# Altium project PCB_High_Voltage_Sensor.PrjPcb
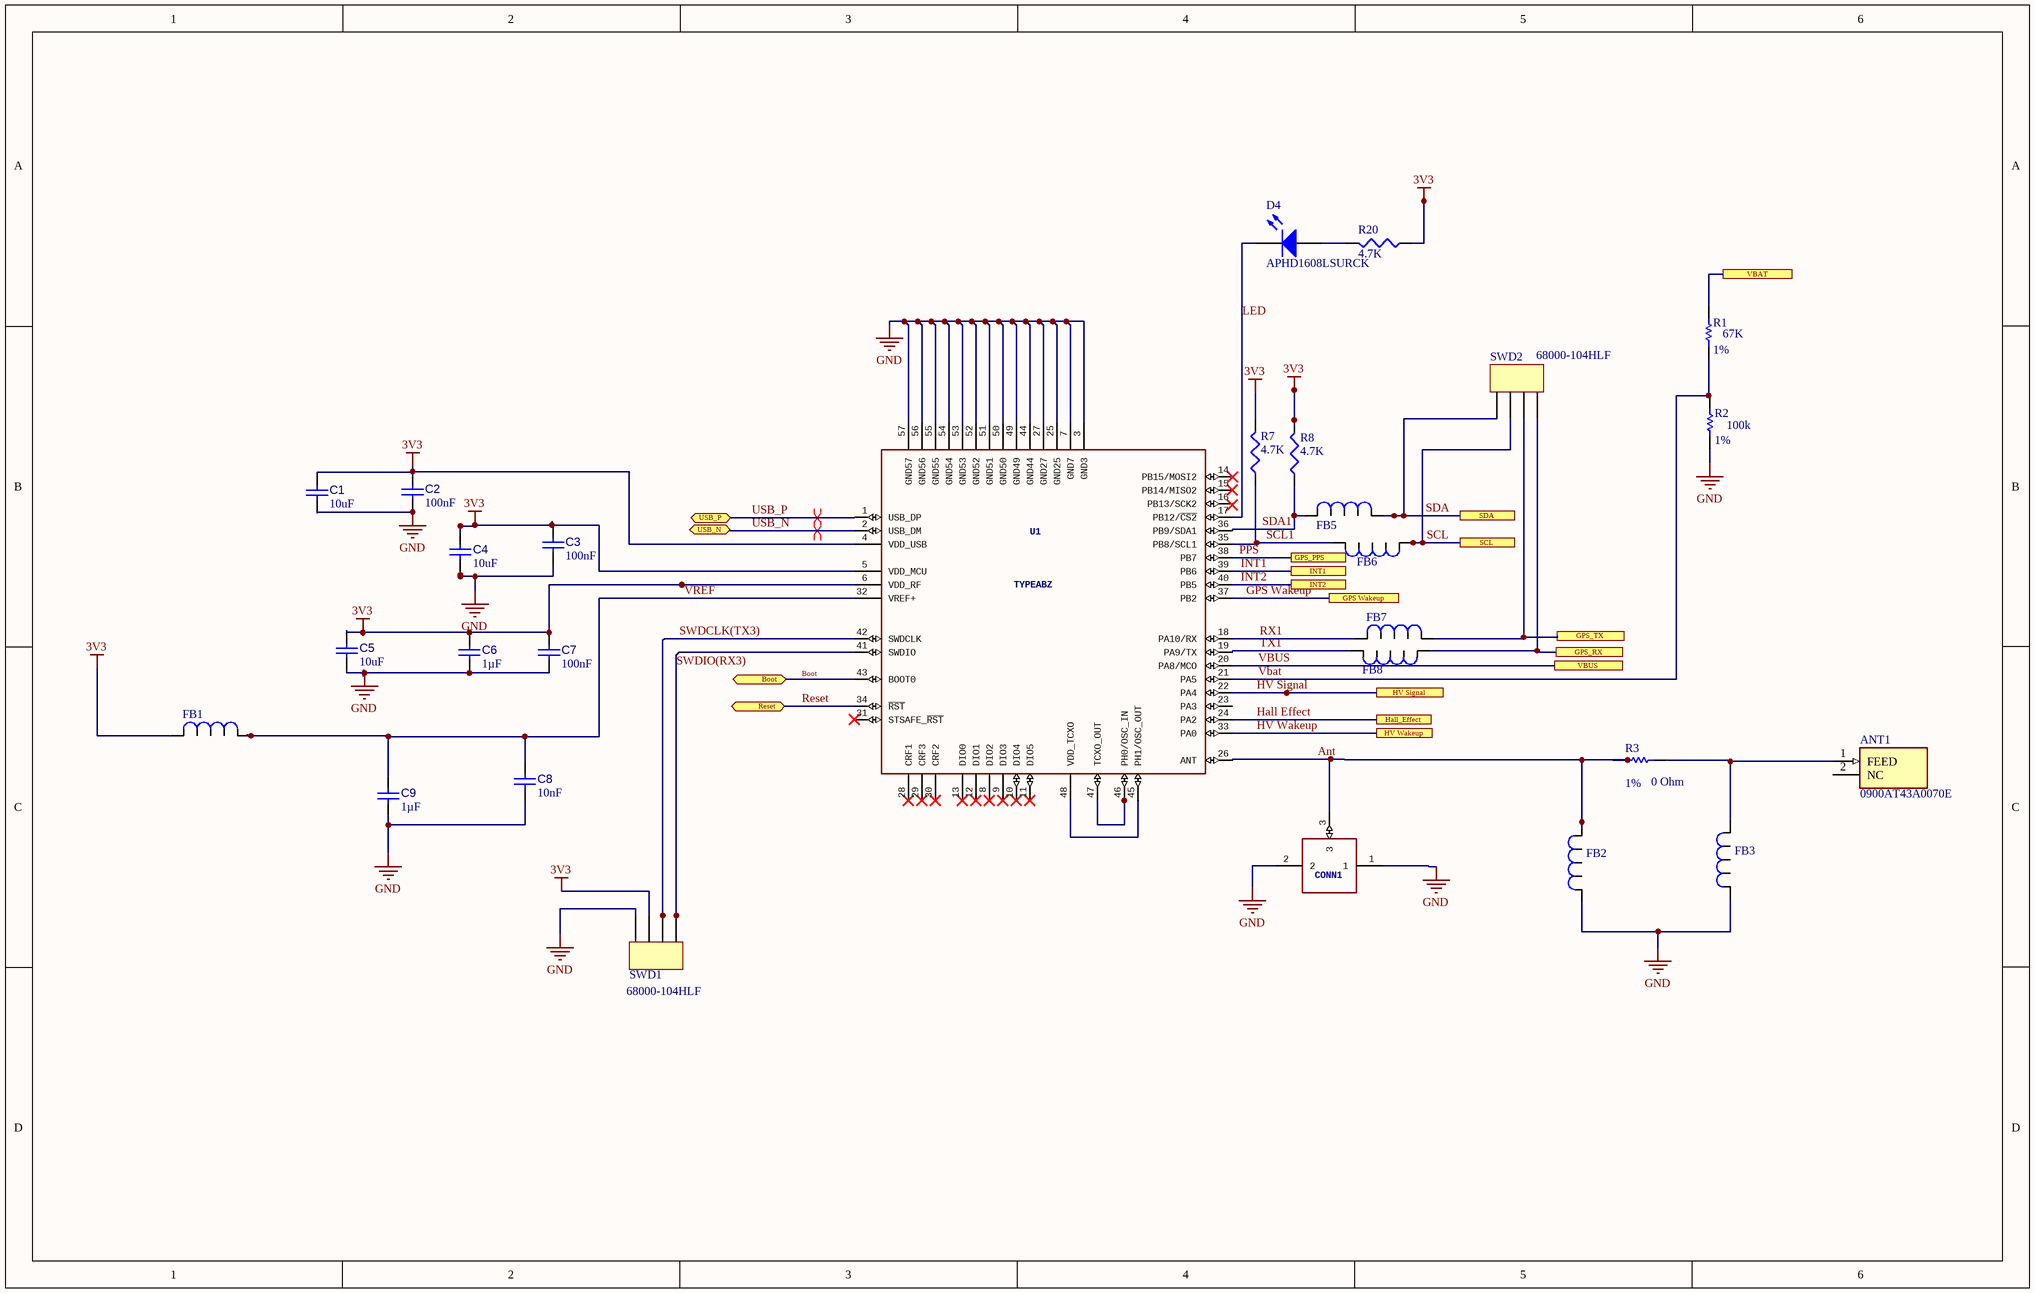
[diagram p0: [1]MCU.SchDoc]
9 sheets, 113 parts. Net scope: flat (ports and power ports of the same name join across sheets).
Board file: PCB_High_Voltage_Sensor.PcbDoc
Sheets:
  [1]MCU.SchDoc
  [2]Battery.SchDoc
  [3]USB.SchDoc
  [4]Button.SchDoc
  [5]High_V_Sensor.SchDoc
  [7]3-axis-accelerometer.SchDoc
  [8]Halleffect.SchDoc
  [9]GPSGNSS.SchDoc
  [6]Battery Managment.SchDoc

## Sheet [1]MCU.SchDoc
size B

### Parts
(Parts that share a designator on the sheet are numbered #1, #2 ... from top to bottom, then left to right.)
ANT1  0900AT43A0070E  [ANTC7020X90N]
C1  value 10uF  [CAPC1608X90X40ML10T20]  (hidden comment: Capacitor 10uF +/-10% 50 V 0603)
C2  value 100nF  [CAPC1608X90X40ML10T20]  (hidden comment: Capacitor 100 nF +/-10% 50 V 0603)
C3  value 100nF  [CAPC1608X90X40ML10T20]  (hidden comment: Capacitor 100 nF +/-10% 50 V 0603)
C4  value 10uF  [CAPC1608X90X40ML10T20]  (hidden comment: Capacitor 10uF +/-10% 50 V 0603)
C5  value 10uF  [CAPC1608X90X40ML10T20]  (hidden comment: Capacitor 10uF +/-10% 50 V 0603)
C6  value 1µF  [CAPC1608X90X40ML10T20]  (hidden comment: Capacitor 1 uF +/- 10% 25 V 0603)
C7  value 100nF  [CAPC1608X90X40ML10T20]  (hidden comment: Capacitor 100 nF +/-10% 50 V 0603)
C8  10nF  [CAPC1608X90X40ML10T20]
C9  value 1µF  [CAPC1608X90X40ML10T20]  (hidden comment: Capacitor 1 uF +/- 10% 25 V 0603)
CONN1  U.FL-R-SMT-1  [U.FL-R-SMT-1]  (value not drawn)
D4  APHD1608LSURCK  [LED BLUE CLEAR [0603] 2mA]
FB1  BLM18AG102SN1D  [Ferrite Bead]  (value not drawn)
FB2  BLM18AG102SN1D  [Ferrite Bead]  (value not drawn)
FB3  BLM18AG102SN1D  [Ferrite Bead]  (value not drawn)
FB5  BLM18AG102SN1D  [Ferrite Bead]  (value not drawn)
FB6  BLM18AG102SN1D  [Ferrite Bead]  (value not drawn)
FB7  BLM18AG102SN1D  [Ferrite Bead]  (value not drawn)
FB8  BLM18AG102SN1D  [Ferrite Bead]  (value not drawn)
R1#1  value 67K  Tolerance: 1%  [RES 0603]  (hidden comment: RES 67K 1% 0.1W [0603])
R2#1  value 100k  Tolerance: 1%  [RES 0603]  (hidden comment: RES 100K 5% 0.1W [0603])
R3  value 0 Ohm  Tolerance: 1%  [RESC0603]  (hidden comment: 0)
R7  4.7K  [RESC0603]
R8  4.7K  [RESC0603]
R20  4.7K  [RESC0603]
SWD1  68000-104HLF  [4POS_HEADER]
SWD2#1  68000-104HLF  [4POS_HEADER]
U1  TYPEABZ  [CMWX1ZZABZ]

### Ports
Boot (bidir), GPS Wakeup, GPS_PPS, GPS_RX, GPS_TX, Hall_Effect, HV Signal, HV Wakeup, INT1, INT2, Reset (bidir), SCL, SDA, USB_N (bidir), USB_P (bidir), VBAT, VBUS

### Nets
3V3: C1.2 C2.2 C3.2 C4.2 C5.2 C6.2 C7.2 FB1.2 R7.2 R8.2 R20.1 SWD1.2 U1.4(VDD_USB) U1.5(VDD_MCU) U1.6(VDD_RF)
GND: C1.1 C2.1 C3.1 C4.1 C5.1 C6.1 C7.1 C8.1 C9.2 CONN1.1 CONN1.2 FB2.2 FB3.2 R2#1.1 SWD1.1 U1.3(GND3) U1.7(GND7) U1.25(GND25) U1.27(GND27) U1.44(GND44) U1.49(GND49) U1.50(GND50) U1.51(GND51) U1.52(GND52) U1.53(GND53) U1.54(GND54) U1.55(GND55) U1.56(GND56) U1.57(GND57)
Ant: CONN1.3 FB2.1 R3.1 U1.26(ANT)
Boot: U1.43(BOOT0) ; port Boot
GPS RX: FB8.1 SWD2#1.1 ; port GPS_RX
GPS TX: FB7.1 SWD2#1.2 ; port GPS_TX
GPS Wakeup: U1.37(PB2) ; port GPS Wakeup
Hall Effect: U1.24(PA2) ; port Hall_Effect
HV Signal: U1.22(PA4) ; port HV Signal
HV Wakeup: U1.33(PA0) ; port HV Wakeup
INT1: U1.39(PB6) ; port INT1
INT2: U1.40(PB5) ; port INT2
LED: D4.1 U1.17(PB12/~{CS2})
PPS: U1.38(PB7) ; port GPS_PPS  [project net GPS_PPS]
Reset: U1.34(~{RST}) ; port Reset
RX1: FB7.2 U1.18(PA10/RX)
SCL: FB6.2 SWD2#1.3 ; port SCL
SCL1: FB6.1 R7.1 U1.35(PB8/SCL1)
SDA: FB5.1 SWD2#1.4 ; port SDA
SDA1: FB5.2 R8.1 U1.36(PB9/SDA1)
SWDCLK(TX3): SWD1.3 U1.42(SWDCLK)
SWDIO(RX3): SWD1.4 U1.41(SWDIO)
TX1: FB8.2 U1.19(PA9/TX)
USB_N: U1.2(USB_DM) ; port USB_N
USB_P: U1.1(USB_DP) ; port USB_P
Vbat: R1#1.1 R2#1.2 U1.21(PA5)
VBUS: U1.20(PA8/MCO) ; port VBUS
VREF: C8.2 C9.1 FB1.1 U1.32(VREF+)
NetANT1_1: ANT1.1(FEED) FB3.1 R3.2
NetD4_2: D4.2 R20.2
NetR1#1_2: R1#1.2 ; port VBAT
NetU1_45: U1.45(PH1/OSC_OUT) U1.48(VDD_TCXO)
NetU1_46: U1.46(PH0/OSC_IN) U1.47(TCXO_OUT)

Not connected (* = marked no-connect by the designer): ANT1 2(NC); U1 8(DIO2)* 9(DIO3)* 10(DIO4)* 11(DIO5)* 12(DIO1)* 13(DIO0)* 14(PB15/MOSI2) 15(PB14/MISO2)* 16(PB13/SCK2) 23(PA3) 28(CRF1)* 29(CRF3)* 30(CRF2)* 31(STSAFE_~{RST})*

### Layout directives
differential pair; differential pair class USBPair: USB_N, USB_P

### Notes on the sheet
- Title
- Size:
- Date:
- A3
- Number:
- Time:
- Revision:
- Sheet
- of
- File:

### Library data of the parts
ANT1 = 0900AT43A0070E: Antenna; Manufacturer_Name: JOHANSON TECHNOLOGY; Datasheet Link: https://www.johansontechnology.com/datasheets/0900AT43A0070/0900AT43A0070.pdf; Height: 0.9mm; Manufacturer_Part_Number: 0900AT43A0070E
C1 C4 C5 = CMP-001-00017-4: Chip Capacitor, 10uF, +/- 10%, 50 V, 0603 (1608 Metric); Capacitor Type: Ceramic; Voltage Rating: 50V; RoHS Compliant: True; Max Operating Temperature: 125°C; Pins: 2; Mounting Technology: SM; Min Operating Temperature: -55°C; Tolerance: 10%; Case/Package: 0603
C2 C3 C7 = CMP-001-00017-4: Chip Capacitor, 100 nF, +/- 10%, 50 V, 0603 (1608 Metric); Capacitor Type: Ceramic; Voltage Rating: 50V; RoHS Compliant: True; Max Operating Temperature: 125°C; Pins: 2; Mounting Technology: SM; Min Operating Temperature: -55°C; Tolerance: 10%; Case/Package: 0603
C6 C9 = CMP-001-00005-4: Chip Capacitor, 1 uF, +/- 10%, 25 V, 0603 (1608 Metric); Voltage Rating: 25V; Capacitor Type: Ceramic; Min Operating Temperature: -55°C; Tolerance: 10%; Max Operating Temperature: 125°C; Case/Package: 0603; RoHS Compliant: True; Mounting Technology: SM; Pins: 2
C8 = CMP-001-00017-4: Chip Capacitor, 10 nF, +/- 10%, 50 V, 0603 (1608 Metric); Capacitor Type: Ceramic; Voltage Rating: 50V; RoHS Compliant: True; Value: 10nF; Max Operating Temperature: 125°C; Pins: 2; Mounting Technology: SM; Min Operating Temperature: -55°C; Tolerance: 10%; Case/Package: 0603
CONN1 = U.FL-R-SMT-1: GateName_1: G$1; SymbolName_1: U.FL-R-SMT-1; LibraryName: Kris; DeviceSetName: U.FL-R-SMT-1
D4 = LED BLUE CLEAR 1608 SMD: LED RED  [0603] 2mA; Datasheet: http://www.kingbrightusa.com/images/catalog/SPEC/APHD1608LQBC-D.pdf; Supplier 1: Digi-Key; Supplier Part Number 1: 754-2034-1-ND; PN: APHD1608LSURCK
FB1-FB3 FB5-FB8 = Ferrite Bead: Ferrite Bead 1KOhm @100MHz; Datasheet: https://www.murata.com/en-us/products/productdata/8796738650142/ENFA0003.pdf?src-supplier=Digi-Key; Supplier 1: Mouser; Supplier Part Number 1: 81-BLM11A102S; PN: BLM18AG102SN1D
R1#1 R2#1 = RES 3.3M 1% 0.1W [0603]: Supplier 1: Digi-Key; Supplier Part Number 1: 541-3.30MHCT-ND
R3 = RES 0 Ohm [0603]: RES 0 Ohm 1% 0.1W [0603]; Supplier 1: Mouser; Supplier Part Number 1: 667-ERJ-3GEY0R00V; Datasheet: http://industrial.panasonic.com/cdbs/www-data/pdf/RDA0000/AOA0000C301.pdf?src-supplier=Farnell
R7 R8 R20 = RESISTOR
SWD1 SWD2#1 = 68000-104HLF: 4 Positions Header, Unshrouded Connector 0.100" (2.54mm) Through Hole Gold or Gold, GXT™; Manufacturer 1: Amphenol FCI; Number of Positions: 4; Gender: Male; Connector Type: Male Pin; Voltage Rating: 1.5kV; Current Rating: 3A; Insulation Resistance: 5GR; Mating Post Length: 5.84mm; Mount: Through Hole; Colour: Black; Housing Colour: Black; Housing Material: Thermoplastic; Contact Plating: Nickel,Gold,GXT; Contact Material: Bronze; Min Operating Temperature: -65°C; Max Operating Temperature: 125°C; Number of Rows: 1; Packaging: Bulk; Package Quantity: 100; Termination: Solder; Number of Contacts: 4; Orientation: Straight; Max Voltage Rating (AC): 1.5kV; Contact Gender: Male; Length: 10.16mm; Pitch: 2.54mm; Depth: 2.41mm; Termination Post Length: 2.41mm; Contact Mating Length: 0.23inch; Radiation Hardening: No; REACH SVHC: No SVHC; Flammability Rating: UL94 V-0; ComponentLink1URL: https://datasheet.ciiva.com/16726/68000-16726213.pdf; ComponentLink1Description: https://datasheet.ciiva.com/16726/68000-16726213.pdf; ComponentLink2URL: https://datasheet.ciiva.com/10149/68000-10149830.pdf; ComponentLink2Description: https://datasheet.ciiva.com/10149/68000-10149830.pdf; ComponentLink3URL: https://datasheet.ciiva.com/46395/1914865-46395854.pdf; ComponentLink3Description: https://datasheet.ciiva.com/46395/1914865-46395854.pdf; ComponentLink4URL: https://datasheet.ciiva.com/728/68000-728879.pdf; ComponentLink4Description: https://datasheet.ciiva.com/728/68000-728879.pdf; Description 1: 4 Positions Header, Unshrouded Connector 0.100" (2.54mm) Through Hole Gold or Gold, GXT™; Manufacturer Part Number 1: 68000-104HLF; Pricing 1: 1=0.33, 10=0.316, 100=0.2212, 500=0.18964, 1000=0.15803, 5000=0.13545, 10000=0.12642 (USD); Stock 1: 10785; Supplier 1: Digi-Key; Supplier Part Number 1: 609-3248-ND
U1 = TYPEABZ: CMWX1ZZABZ-078; GateName_1: G$1; SymbolName_1: TYPEABZ; DeviceSetName: TYPEABZ

## Sheet [2]Battery.SchDoc
size B
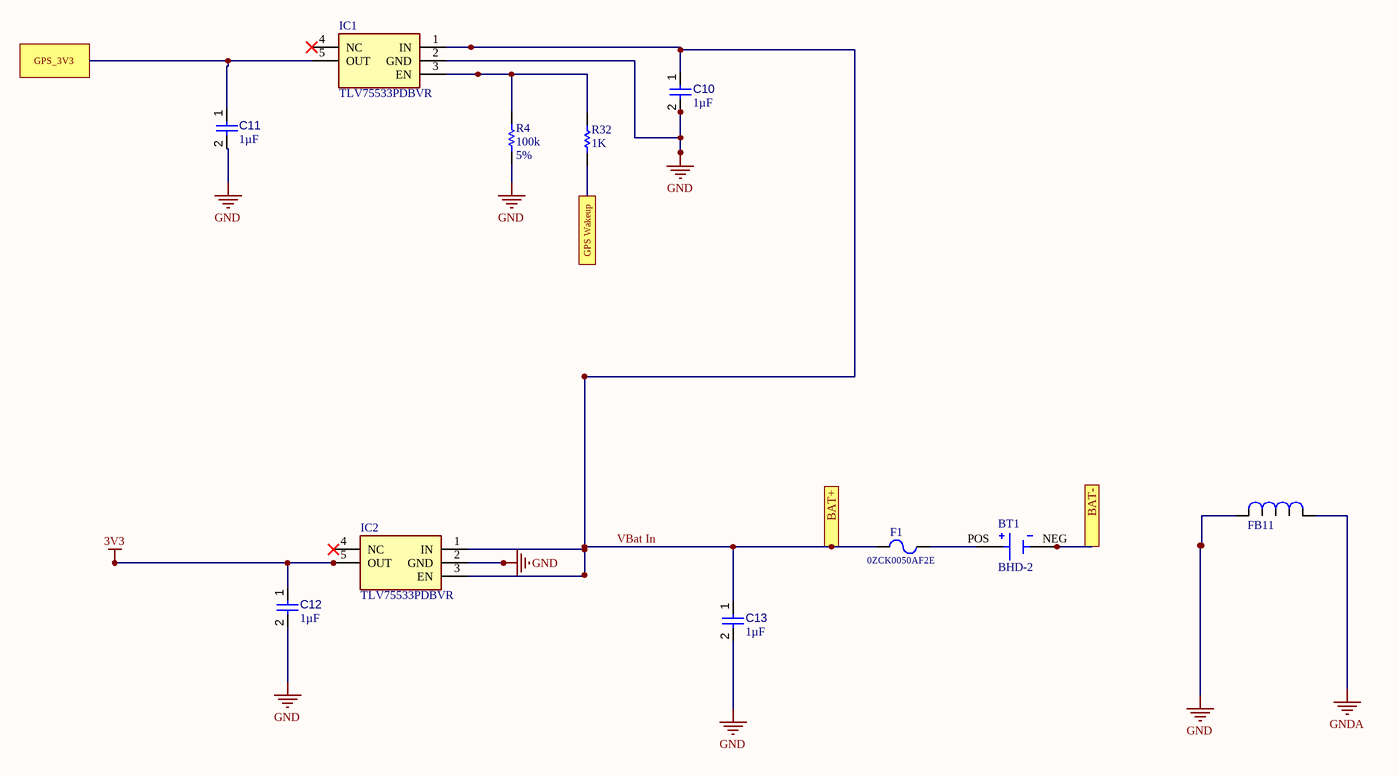
[diagram p1: [2]Battery.SchDoc]

### Parts
BT1  BHD-2  [BAT_BHD-2]
C10  value 1µF  [CAPC1608X90X40ML10T20]  (hidden comment: Capacitor 1 uF +/- 10% 25 V 0603)
C11  value 1µF  [CAPC1608X90X40ML10T20]  (hidden comment: Capacitor 1 uF +/- 10% 25 V 0603)
C12  value 1µF  [CAPC1608X90X40ML10T20]  (hidden comment: Capacitor 1 uF +/- 10% 25 V 0603)
C13  value 1µF  [CAPC1608X90X40ML10T20]  (hidden comment: Capacitor 1 uF +/- 10% 25 V 0603)
F1  MF PN: 0ZCK0050AF2E  [PTC RESET FUSE 9V 500MA 0805]  (hidden comment: PTC 9V 500mA)
FB11  BLM18AG102SN1D  [Ferrite Bead]  (value not drawn)
IC1  TLV75533PDBVR  [SOT95P280X145-5N]
IC2  TLV75533PDBVR  [SOT95P280X145-5N]
R4  value 100k  Tolerance: 5%  [RES 0603]  (hidden comment: RES 100K 5% 0.1W [0603])
R32  1K  [RES 0603]

### Ports
BAT+, BAT-, GPS Wakeup, GPS_3V3

### Nets
3V3: C12.1 IC2.5(OUT)
GND: C10.2 C11.2 C12.2 C13.2 FB11.2 IC1.2(GND) IC2.2(GND) R4.1
GNDA: FB11.1
BAT-: BT1.NEG ; port BAT-
GPS VCC: C11.1 IC1.5(OUT) ; port GPS_3V3
GPS Wakeup: R32.2 ; port GPS Wakeup
VBat In: C10.1 C13.1 F1.1 IC1.1(IN) IC2.1(IN) IC2.3(EN) ; port BAT+
NetBT1_POS: BT1.POS F1.2
NetIC1_3: IC1.3(EN) R4.2 R32.1

Not connected (* = marked no-connect by the designer): IC1 4(NC)*; IC2 4(NC)*

### Notes on the sheet
- Title
- Size:
- Date:
- A3
- Number:
- Time:
- Revision:
- Sheet
- of
- File:

### Library data of the parts
BT1 = BHD-2: BATTERY HOLDER D PC PIN; MF: MPD; Value: *; Package: None; MP: BHD-2; Price: None; Availability: Bad; SnapEDA_Link: https://www.snapeda.com/parts/BHD-2/Memory%20Protection%20Devices/view-part/4219639/?ref=snap; BuyPart: https://www.snapeda.com/parts/BHD-2/Memory%20Protection%20Devices/view-part/4219639/?ref=eda
C10-C13 = CMP-001-00005-4: as C6 on sheet [1]MCU; Min Operating Temperature: -55°C; Tolerance: 10%; Max Operating Temperature: 125°C; Case/Package: 0603; RoHS Compliant: True; Mounting Technology: SM; Pins: 2
F1 = PTC RESET FUSE 9V 500MA 0805: DK PN: 507-2075-1-ND; Supplier 1: Digi-Key; Supplier Part Number 1: 507-2075-1-ND; Datasheet: https://www.belfuse.com/resources/datasheets/circuitprotection/ds-cp-0zck-series.pdf
FB11 = Ferrite Bead: Ferrite Bead 1KOhm @100MHz; Datasheet: https://www.murata.com/en-us/products/productdata/8796738650142/ENFA0003.pdf?src-supplier=Digi-Key; Supplier 1: Mouser; Supplier Part Number 1: 81-BLM11A102S; PN: BLM18AG102SN1D
IC1 IC2 = TLV75533PDBVR: Integrated Circuit; Manufacturer_Name: Texas Instruments; Datasheet Link: http://www.ti.com/lit/gpn/tlv755p; Height: 1.45mm; Manufacturer_Part_Number: TLV75533PDBVR; Mouser Part Number: 595-TLV75533PDBVR; Mouser Price/Stock: https://www.mouser.co.uk/ProductDetail/Texas-Instruments/TLV75533PDBVR?qs=55YtniHzbhAKEwqeO2xJXQ%3D%3D; Arrow Part Number: TLV75533PDBVR; Arrow Price/Stock: https://www.arrow.com/en/products/tlv75533pdbvr/texas-instruments
R4 = RES 3.3M 1% 0.1W [0603]: Supplier 1: Digi-Key; Supplier Part Number 1: 541-3.30MHCT-ND
R32 = RES 3.3M 1% 0.1W [0603]: 1K 1% 0.1W [0603]; Value: 1M; Supplier 1: Digi-Key; Supplier Part Number 1: 541-3.30MHCT-ND; Tolerance: 1%

## Sheet [3]USB.SchDoc
size B
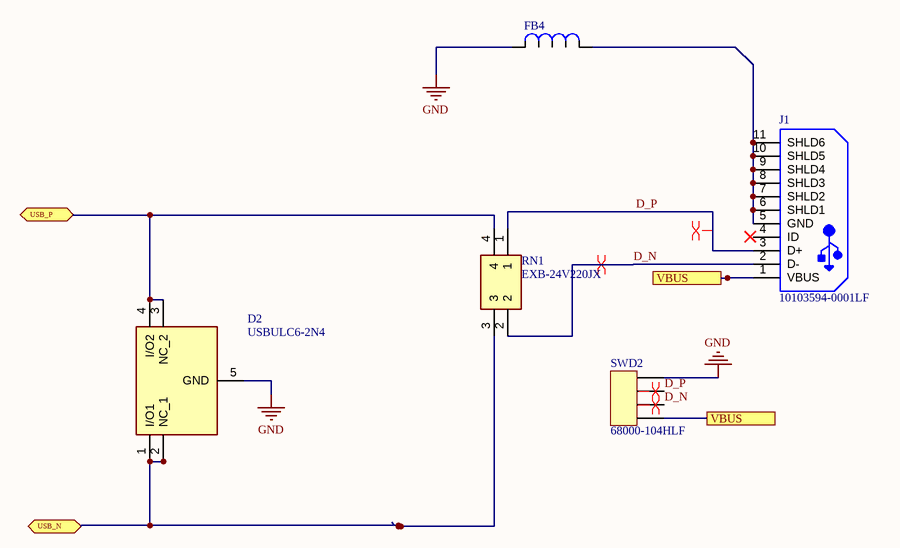
[diagram p2: [3]USB.SchDoc]

### Parts
(Parts that share a designator on the sheet are numbered #1, #2 ... from top to bottom, then left to right.)
D2  USBULC6-2N4  [SON40P100X80X55-5N-D]
FB4  BLM18AG102SN1D  [Ferrite Bead]  (value not drawn)
J1  10103594-0001LF  [FCI-10103594-0001LF_V]
RN1  EXB-24V220JX  [EXB24V220JX]
SWD2#2  68000-104HLF  [4POS_HEADER]

### Ports
USB_N (bidir), USB_P (bidir), VBUS

### Nets
GND: D2.5(GND) FB4.2 SWD2#2.1
D_N: J1.2(D-) RN1.2 SWD2#2.3
D_P: J1.3(D+) RN1.1 SWD2#2.2
USB_N: D2.1(I/O1) D2.2(NC_1) RN1.3 ; port USB_N
USB_P: D2.3(NC_2) D2.4(I/O2) RN1.4 ; port USB_P
VBUS: J1.1(VBUS) SWD2#2.4 ; port VBUS
NetFB4_1: FB4.1 J1.5(GND) J1.6(SHLD1) J1.7(SHLD2) J1.8(SHLD3) J1.9(SHLD4) J1.10(SHLD5) J1.11(SHLD6)

Not connected (* = marked no-connect by the designer): J1 4(ID)

### Layout directives
differential pair; differential pair class USBPair1: (no net found under the mark), D_N, D_P

### Notes on the sheet
- 8
- 7
- 6
- 5
- 4
- 3
- DWG. NO.
- REV.
- SHT.
- REVISION
- 2
- DESCRIPTION
- DATE
- 1
- APPROVED
- THIS DOCUMENT AND THE DATA DISCLOSED HEREIN OR HEREWITH IS THE PROPERTY OF ALTIUM LIMITED AND MAY BE FREELY DISTRIBUTED IN WHOLE. NO RIGHTS ARE RESERVED OR EXPRESS OR IMPLIED WARANTEE GIVEN.
- F
- E
- D
- C
- B
- A
- SCALE:
- A3
- SIZE
- CAGE CODE
- FILE NAME
- DWG NO.
- SHEET
- OF
- REV

### Library data of the parts
D2 = USBULC6-2N4: TVS Diode (Bi-directional); Manufacturer_Name: STMicroelectronics; Datasheet Link: https://www.mouser.com/datasheet/2/389/usbulc6-2n4-957402.pdf; Height: 0.55mm; Manufacturer_Part_Number: USBULC6-2N4; Arrow Part Number: USBULC6-2N4; Arrow Price/Stock: https://www.arrow.com/en/products/usbulc6-2n4/stmicroelectronics; Mouser Part Number: 511-USBULC6-2N4; Mouser Price/Stock: https://www.mouser.co.uk/ProductDetail/STMicroelectronics/USBULC6-2N4?qs=Rlwi1sSxVL7F1p%2FNjkpR0Q%3D%3D
FB4 = Ferrite Bead: Ferrite Bead 1KOhm @100MHz; Datasheet: https://www.murata.com/en-us/products/productdata/8796738650142/ENFA0003.pdf?src-supplier=Digi-Key; Supplier 1: Mouser; Supplier Part Number 1: 81-BLM11A102S; PN: BLM18AG102SN1D
J1 = CMP-002-00038-1: Micro USB 2.0 B Receptacle, 5 Position, Height 3.24 mm, -55 to 85 degC, RoHS, Tape and Reel; Manufacturer: FCI Electronics; Voltage Rating: 100V; Gender: Female; Current Rating: 1.8A; Min Operating Temperature: -55°C; Pins: 5; Contact Plating: Gold; Package Description: 5-Pin Surface Mount Device, Body 8.04 x 5.62 mm; RoHS Compliant: True; Lead Pitch: 0.65mm; Packaging: TapeandReel; Case/Package: FCI-10103594-0001LF; Manufacturer URL: http://portal.fciconnect.com/; Mounting Technology: SM; Datasheet Version: Rev. A, 06/2010; Connector Type: USB; Contact Material: Copper; Datasheet URL: http://portal.fciconnect.com/Comergent//fci/drawing/10103594.pdf; Max Operating Temperature: 85°C; Package Quantity: 1500; Package Reference: FCI-10103594-0001LF
RN1 = EXB-24V220JX: Resistor Network; Manufacturer_Name: Panasonic; Datasheet Link: https://www.snapeda.com/parts/EXB-24V220JX/Panasonic%20Electronic/datasheet/; Height: 0.45mm; Manufacturer_Part_Number: EXB-24V220JX; Mouser Part Number: 667-EXB-24V220JX; Mouser Price/Stock: https://www.mouser.co.uk/ProductDetail/Panasonic/EXB-24V220JX?qs=oE3VwAv%2FYtkKhK0m4TkqFQ%3D%3D
SWD2#2 = 68000-104HLF: as SWD1 on sheet [1]MCU; Mount: Through Hole; Colour: Black; Housing Colour: Black; Housing Material: Thermoplastic; Contact Plating: Nickel,Gold,GXT; Contact Material: Bronze; Min Operating Temperature: -65°C; Max Operating Temperature: 125°C; Number of Rows: 1; Packaging: Bulk; Package Quantity: 100; Termination: Solder; Number of Contacts: 4; Orientation: Straight; Max Voltage Rating (AC): 1.5kV; Contact Gender: Male; Length: 10.16mm; Pitch: 2.54mm; Depth: 2.41mm; Termination Post Length: 2.41mm; Contact Mating Length: 0.23inch; Radiation Hardening: No; REACH SVHC: No SVHC; Flammability Rating: UL94 V-0; ComponentLink1URL: https://datasheet.ciiva.com/16726/68000-16726213.pdf; ComponentLink1Description: https://datasheet.ciiva.com/16726/68000-16726213.pdf; ComponentLink2URL: https://datasheet.ciiva.com/10149/68000-10149830.pdf; ComponentLink2Description: https://datasheet.ciiva.com/10149/68000-10149830.pdf; ComponentLink3URL: https://datasheet.ciiva.com/46395/1914865-46395854.pdf; ComponentLink3Description: https://datasheet.ciiva.com/46395/1914865-46395854.pdf; ComponentLink4URL: https://datasheet.ciiva.com/728/68000-728879.pdf; ComponentLink4Description: https://datasheet.ciiva.com/728/68000-728879.pdf; Description 1: 4 Positions Header, Unshrouded Connector 0.100" (2.54mm) Through Hole Gold or Gold, GXT™; Manufacturer Part Number 1: 68000-104HLF; Pricing 1: 1=0.33, 10=0.316, 100=0.2212, 500=0.18964, 1000=0.15803, 5000=0.13545, 10000=0.12642 (USD); Stock 1: 10785; Supplier 1: Digi-Key; Supplier Part Number 1: 609-3248-ND

## Sheet [4]Button.SchDoc
size B
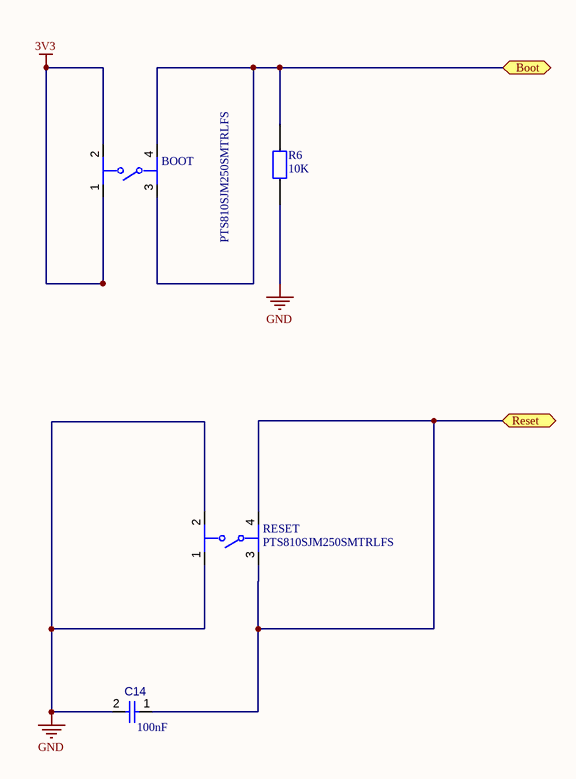
[diagram p3: [4]Button.SchDoc]

### Parts
BOOT  PTS810SJM250SMTRLFS  [FP-PTS810SJM250SMTRLFS-MFG]
C14  value 100nF  [CAPC1608X90X40ML10T20]  (hidden comment: Capacitor 100 nF +/-10% 50 V 0603)
R6  10K  [RESC0603]
RESET  PTS810SJM250SMTRLFS  [FP-PTS810SJM250SMTRLFS-MFG]

### Ports
Boot (bidir), Reset (bidir)

### Nets
3V3: BOOT.1 BOOT.2
GND: C14.2 R6.1 RESET.1 RESET.2
Boot: BOOT.3 BOOT.4 R6.2 ; port Boot
Reset: C14.1 RESET.3 RESET.4 ; port Reset

### Notes on the sheet
- 8
- 7
- 6
- 5
- 4
- 3
- DWG. NO.
- REV.
- SHT.
- REVISION
- 2
- DESCRIPTION
- DATE
- 1
- APPROVED
- THIS DOCUMENT AND THE DATA DISCLOSED HEREIN OR HEREWITH IS THE PROPERTY OF ALTIUM LIMITED AND MAY BE FREELY DISTRIBUTED IN WHOLE. NO RIGHTS ARE RESERVED OR EXPRESS OR IMPLIED WARANTEE GIVEN.
- F
- E
- D
- C
- B
- A
- SCALE:
- A3
- SIZE
- CAGE CODE
- FILE NAME
- DWG NO.
- SHEET
- OF
- REV

### Library data of the parts
BOOT RESET = Button: SWITCH TACTILE SPST-NO 0.05A 16V; Manufacturer: C&K Components; Throw Configuration: SPST; Contact Resistance: 500mΩ; Electromechanical Life: 150000Cycles; Operating Force: 160gf; Contact Current Rating: 50mA; Temperature: -40°C to +85°C; Device Class L2: Switches; Digikey Description: SWITCH TACTILE SPST-NO 0.05A 16V; Automotive: No; Height: 2.7mm; ComponentLink2Description: Datasheet; Temperature Range Low: -40°C; Device Class L1: Electromechanical; Mouser Description: Switch Tactile N.O. SPST Button J-Bend 0.05A 16VDC 150000Cycles 1.57N SMD T/R; Octopart: https://octopart.com/pts810+sjm+250+smtr+lfs-c%26k+components-29687929; Lead Free: Yes; Voltage Rating Dc: 16V; Temperature Range High: +85°C; Package: PTS810SJM250SMTRLFS; Manufacturer Part Number: PTS810SJM250SMTRLFS; ComponentLink2URL: https://www.ckswitches.com/media/1476/pts810.pdf; Category: Switch; RoHS: TRUE; Device Class L3: Tactile Switches
C14 = CMP-001-00017-4: as C2 on sheet [1]MCU; RoHS Compliant: True; Max Operating Temperature: 125°C; Pins: 2; Mounting Technology: SM; Min Operating Temperature: -55°C; Tolerance: 10%; Case/Package: 0603
R6 = ERJ-PA3F1002V: RES SMD 10K OHM 1% 1/4W 0603; Manufacturer: Panasonic Electronic Components; Power (Watts): 0.25W, 1/4W; Temperature Coefficient: ±100ppm/°C; Supplier 1: Digi-Key; Manufacturer Part Number: ERJ-PA3F1002V; RoHS: RoHS Compliant; Category: Resistors; Stock 1: 80783; Pricing 1: 1=0.23, 10=0.205, 25=0.142, 50=0.1102, 100=0.0789, 250=0.06144, 500=0.04884, 1000=0.03467 (CAD); Packaging: Digi-Reel®; Part Status: Active; Resistance (Ohms): 10k; Tolerance: ±1%; Composition: Thick Film; Features: Automotive AEC-Q200, Pulse Withstanding; Operating Temperature: -55°C ~ 155°C; Package / Case: 0603 (1608 Metric); Supplier Device Package: 0603; Size / Dimension: 0.063" L x 0.031" W (1.60mm x 0.80mm); Height - Seated (Max): 0.022" (0.55mm); Failure Rate: -; ComponentLink1URL: https://industrial.panasonic.com/cdbs/www-data/pdf/RDO0000/AOA0000C291.pdf; ComponentLink1Description: https://industrial.panasonic.com/cdbs/www-data/pdf/RDO0000/AOA0000C291.pdf; Supplier Part Number 1: P10KBYDKR-ND

## Sheet [5]High_V_Sensor.SchDoc
size B; SheetNumber: 0; SheetTotal: 0
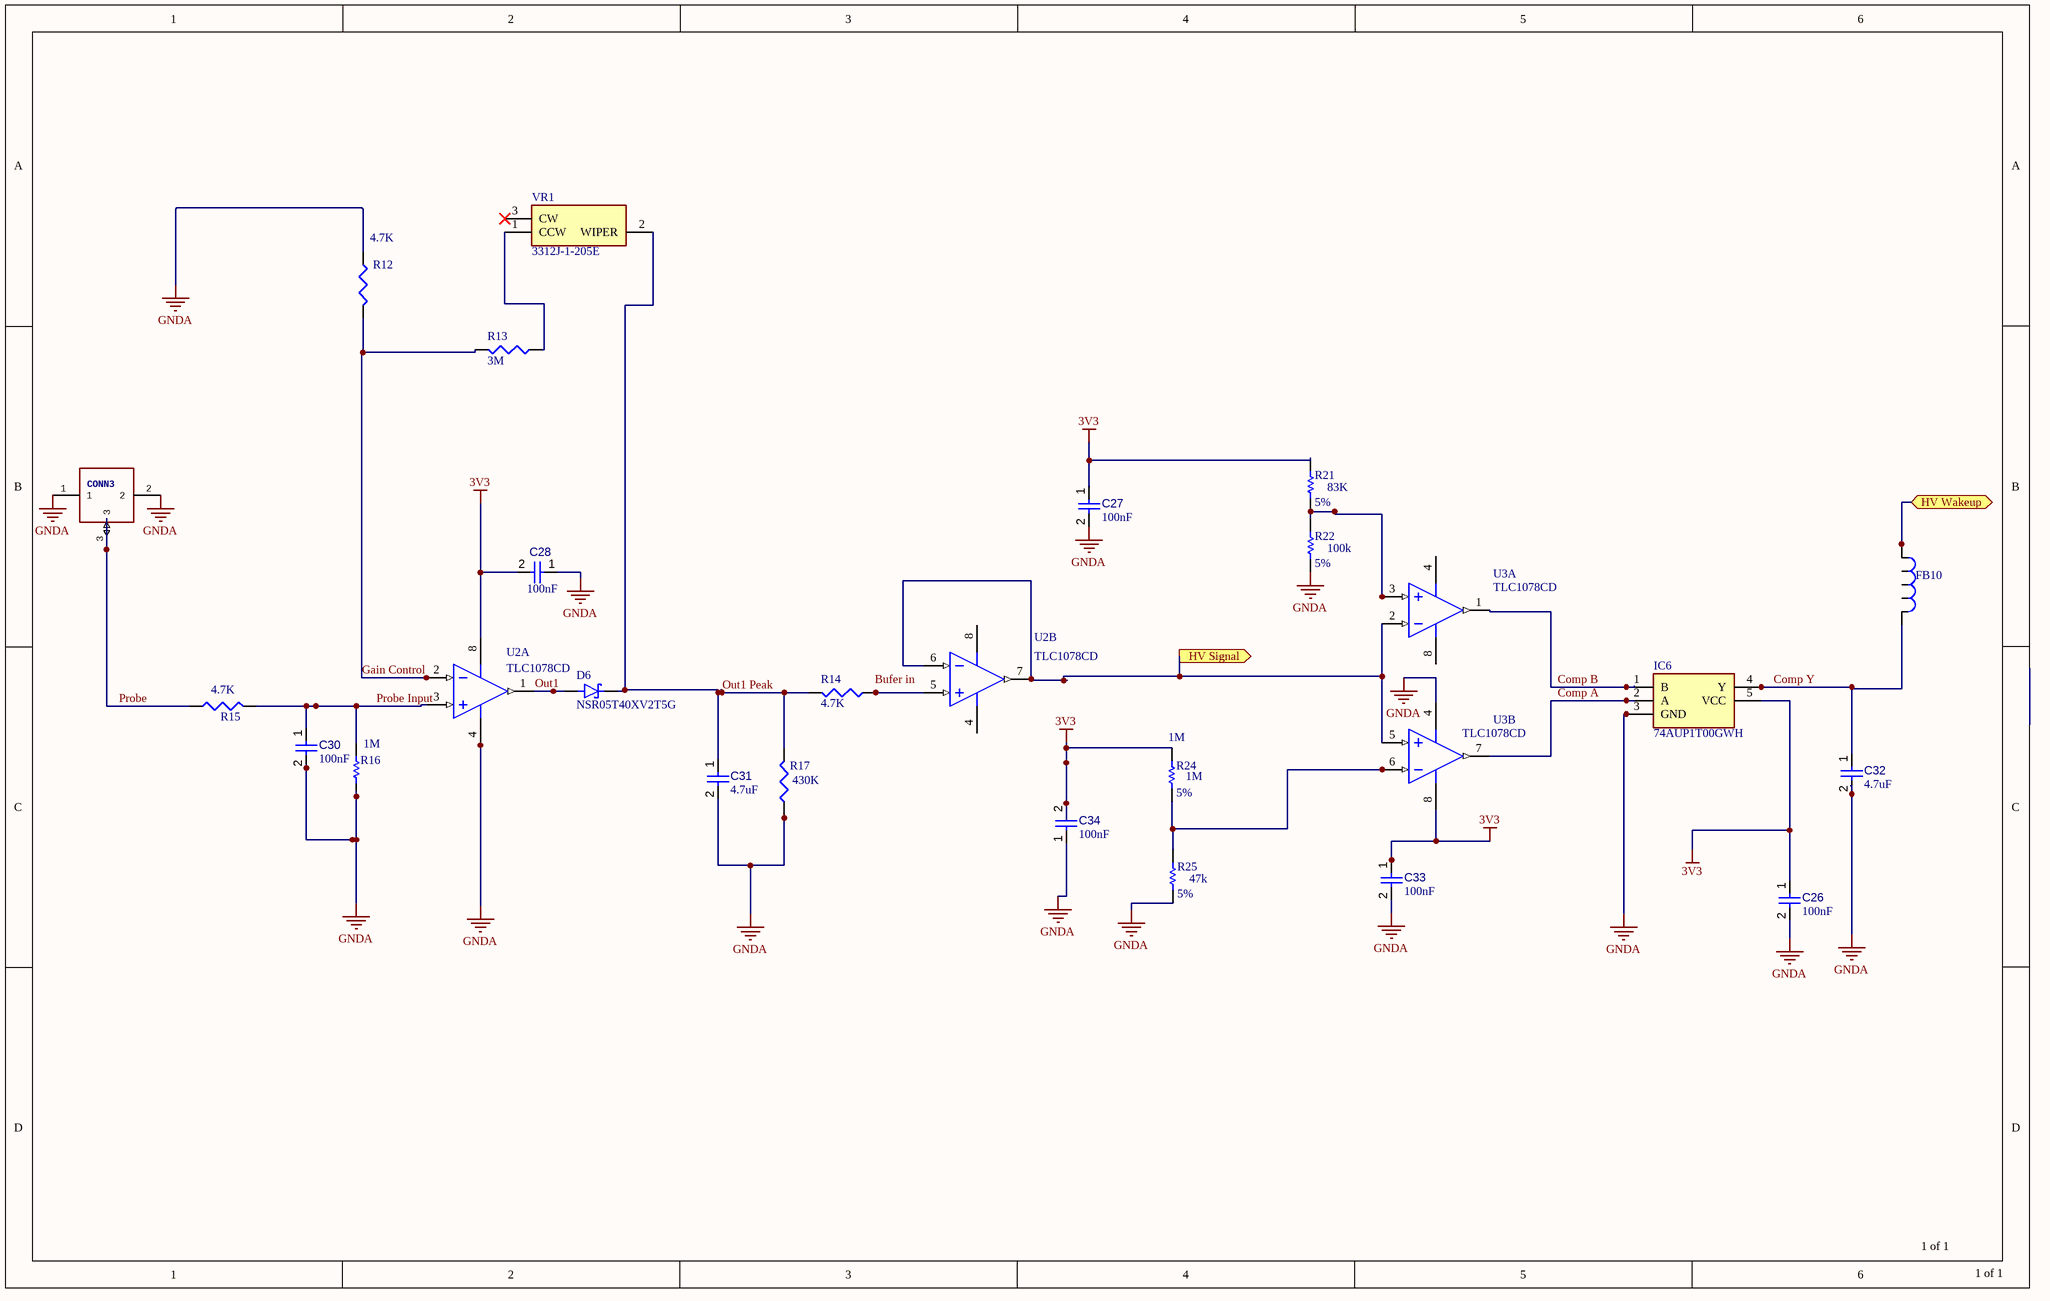
[diagram p4: [5]High_V_Sensor.SchDoc]

### Parts
C26  value 100nF  [CAPC1608X90X40ML10T20]  (hidden comment: Capacitor 100 nF +/-10% 50 V 0603)
C27  value 100nF  [CAPC1608X90X40ML10T20]  (hidden comment: Capacitor 100 nF +/-10% 50 V 0603)
C28  value 100nF  [CAPC1608X90X40ML10T20]  (hidden comment: Capacitor 100 nF +/-10% 50 V 0603)
C30  value 100nF  [CAPC1608X90X40ML10T20]  (hidden comment: Capacitor 100 nF +/-10% 50 V 0603)
C31  4.7uF  [CAPC1608X90X40ML10T20]
C32  4.7uF  [CAPC1608X90X40ML10T20]
C33  value 100nF  [CAPC1608X90X40ML10T20]  (hidden comment: Capacitor 100 nF +/-10% 50 V 0603)
C34  value 100nF  [CAPC1608X90X40ML10T20]  (hidden comment: Capacitor 100 nF +/-10% 50 V 0603)
CONN3  U.FL-R-SMT-1  [U.FL-R-SMT-1]  (value not drawn)
D6  NSR05T40XV2T5G  [DIOM1006X40N]
FB10  BLM18AG102SN1D  [Ferrite Bead]  (value not drawn)
IC6  74AUP1T00GWH  [SOT65P212X110-5N]
R12  4.7K  [RESC0603]
R13  3M  [RESC0603]
R14  4.7K  [RESC0603]
R15  4.7K  [RESC0603]
R16  1M  [RES 0603]
R17  430K  [RESC0603]
R21  value 83K  Tolerance: 5%  [RES 0603]  (hidden comment: 83.3K)
R22  value 100k  Tolerance: 5%  [RES 0603]  (hidden comment: RES 100K 5% 0.1W [0603])
R24  1M  Tolerance: 5%  [RES 0603]
R25  value 47k  Tolerance: 5%  [RES 0603]  (hidden comment: RES 47K 5% 0.1W [0603])
U2  TLC1078CD  [D0008A_N]  (parts A,B of 2)
U3  TLC1078CD  [D0008A_N]  (parts A,B of 2)
VR1  3312J-1-205E  [3312J1502E]

### Ports
HV Signal (out), HV Wakeup (bidir)

### Nets
3V3: C26.1 C27.1 C28.2 C33.1 C34.2 IC6.5(VCC) R21.2 R24.2 U2.8(VDD) U3.8(VDD)
GNDA: C26.2 C27.2 C28.1 C30.2 C31.2 C32.2 C33.2 C34.1 CONN3.1 CONN3.2 IC6.3(GND) R12.1 R16.1 R17.1 R22.1 R25.1 U2.4(GND) U3.4(GND)
Comp A: IC6.2(A) U3.7(OUT2)
Comp B: IC6.1(B) U3.1(OUT1)
Comp Y: C32.1 FB10.2 IC6.4(Y)
Gain Control: R12.2 R13.2 U2.2(IN1-)
HV Signal: U2.6(IN2-) U2.7(OUT2) U3.2(IN1-) U3.5(IN2+) ; port HV Signal
HV Wakeup: FB10.1 ; port HV Wakeup
Out1: D6.A U2.1(OUT1)
Out1 Peak: C31.1 D6.C(K) R14.2 R17.2 VR1.2(WIPER)
Probe: CONN3.3 R15.1
Probe Input: C30.1 R15.2 R16.2 U2.3(IN1+)
NetR13_1: R13.1 VR1.1(CCW)
NetR14_1: R14.1 U2.5(IN2+)
NetR21_1: R21.1 R22.2 U3.3(IN1+)
NetR24_1: R24.1 R25.2 U3.6(IN2-)

Not connected (* = marked no-connect by the designer): VR1 3(CW)*

### Notes on the sheet
- 1 of 1
- Labels drawn without touching a wire or pin: Bufer in

### Library data of the parts
C26-C28 C30 C33 C34 = CMP-001-00017-4: as C2 on sheet [1]MCU; RoHS Compliant: True; Max Operating Temperature: 125°C; Pins: 2; Mounting Technology: SM; Min Operating Temperature: -55°C; Tolerance: 10%; Case/Package: 0603
C31 C32 = CMP-001-00017-4: Chip Capacitor, 4.7uF, +/- 10%, 50 V, 0603 (1608 Metric); Capacitor Type: Ceramic; Voltage Rating: 50V; RoHS Compliant: True; Value: 4.7uF; Max Operating Temperature: 125°C; Pins: 2; Mounting Technology: SM; Min Operating Temperature: -55°C; Tolerance: 10%; Case/Package: 0603
CONN3 = U.FL-R-SMT-1: GateName_1: G$1; SymbolName_1: U.FL-R-SMT-1; LibraryName: Kris; DeviceSetName: U.FL-R-SMT-1
D6 = NSR0530P2T5G: Diode Schottky 30V 500mA (DC) Surface Mount SOD-923; MF: ON Semiconductor; SnapEDA_Link: https://www.snapeda.com/parts/NSR0530P2T5G/ON%20Semiconductor/view-part/435832/?ref=snap; Arrow_Asia-Purchase-URL: https://snapeda.com/shop?store=Arrow+Asia&id=435832; Mouser-Purchase-URL: https://snapeda.com/shop?store=Mouser&id=435832; Availability: Good; DigiKey-Purchase-URL: https://snapeda.com/shop?store=DigiKey&id=435832; MP: NSR0530P2T5G; Package: SOD-923-2 ON Semiconductor; Value: *; Price: None; Arrow_Electronics-Purchase-URL: https://snapeda.com/shop?store=Arrow+Electronics&id=435832; Check_prices: https://www.snapeda.com/parts/NSR0530P2T5G/ON%20Semiconductor/view-part/435832/?ref=eda
FB10 = Ferrite Bead: Ferrite Bead 1KOhm @100MHz; Datasheet: https://www.murata.com/en-us/products/productdata/8796738650142/ENFA0003.pdf?src-supplier=Digi-Key; Supplier 1: Mouser; Supplier Part Number 1: 81-BLM11A102S; PN: BLM18AG102SN1D
IC6 = 74AUP1T87GWH: Integrated Circuit; Manufacturer_Name: Nexperia; Datasheet Link: https://assets.nexperia.com/documents/data-sheet/74AUP1T87.pdf; Height: 1.1mm; Manufacturer_Part_Number: 74AUP1T00GWH; Mouser Part Number: 771-74AUP1T87GWH; Mouser Price/Stock: https://www.mouser.com/Search/Refine.aspx?Keyword=771-74AUP1T87GWH; Arrow Part Number: 74AUP1T87GWH; Arrow Price/Stock: https://www.arrow.com/en/products/74aup1t87gwh/nexperia
R12-R15 R17 = RESISTOR
R16 R24 = RES 3.3M 1% 0.1W [0603]: 1M 1% 0.1W [0603]; Supplier 1: Digi-Key; Supplier Part Number 1: 541-3.30MHCT-ND; Value: 1M
  R16: Tolerance: 1%
R21 = RES 3.3M 1% 0.1W [0603]: RES 83.3K 1% 0.1W [0603]; Supplier 1: Digi-Key; Supplier Part Number 1: 541-3.30MHCT-ND
R22 R25 = RES 3.3M 1% 0.1W [0603]: Supplier 1: Digi-Key; Supplier Part Number 1: 541-3.30MHCT-ND
U2 U3 = TLC1078: Dual Micropower Precision Low-Voltage Operational Amplifier, 1.4 to 16 V, 0 to 70 degC, 8-pin SOIC (D8), Green (RoHS & no Sb/Br); Manufacturer: Texas Instruments; CMRR(Min)(dB): 70; Rating: Catalog; Vio (25C)(Max)(mV): 0.45; Slew Rate(Typ)(V/us): 32; Total Supply Voltage(Min)(+5V is 5, +/-5V is 10): 1.4; Total Supply Voltage(Max)(+5V is 5, +/-5V is 10): 16; Sub Family: Low Offset Voltage Amplifier (<=500uV), Low Power Amp (<=500uA), Low Supply Voltage Amplifier (<=2.7V), Precision Amplifier; Packing: TUBE; Number of Channels: 2; GBW(Typ)(MHz): 0.085; IIB(Max)(pA): 60; Iq per channel(Max)(mA): 0.017; Offset Drift(Typ)(uV/C): 1.1; ComponentLink1Description: Manufacturer URL; ComponentLink3URL: http://www.ti.com/litv/pdf/msoi002j; PackageDescription: 8-Pin Plastic Small Outline, Body 4.9 x 3.9 mm, Pitch 1.27 mm; ComponentLink2Description: Datasheet; ComponentLink2URL: http://www.ti.com/lit/ds/symlink/tlc1078.pdf; PackageVersion: 4040047-3/M, 06/2011; Mounting Technology: Surface Mount; PartNumber: TLC1078CD; DatasheetVersion: SLOS179A; Eco-Plan: Green (RoHS & no Sb/Br); ComponentLink3Description: Package Specification; PackageReference: D0008A; ComponentLink1URL: http://www.ti.com/; Code_JEDEC: MS-012
VR1 = 3312J-1-502E: Variable Resistor, 2M Ohm; Manufacturer_Name: Bourns; Datasheet Link: https://componentsearchengine.com/Datasheets/2/3312J-1-502E.pdf; Height: 2mm; Manufacturer_Part_Number: 3312J-1-205; Mouser Part Number: 652-3312J-1-205E; Mouser Price/Stock: https://www.mouser.co.uk/ProductDetail/Bourns/3312J-1-502E?qs=4GfDZFxiN8vu5YclxULe3Q%3D%3D; Arrow Part Number: 3312J-1-502E; Arrow Price/Stock: https://www.arrow.com/en/products/3312j-1-502e/bourns

## Sheet [7]3-axis-accelerometer.SchDoc
size B
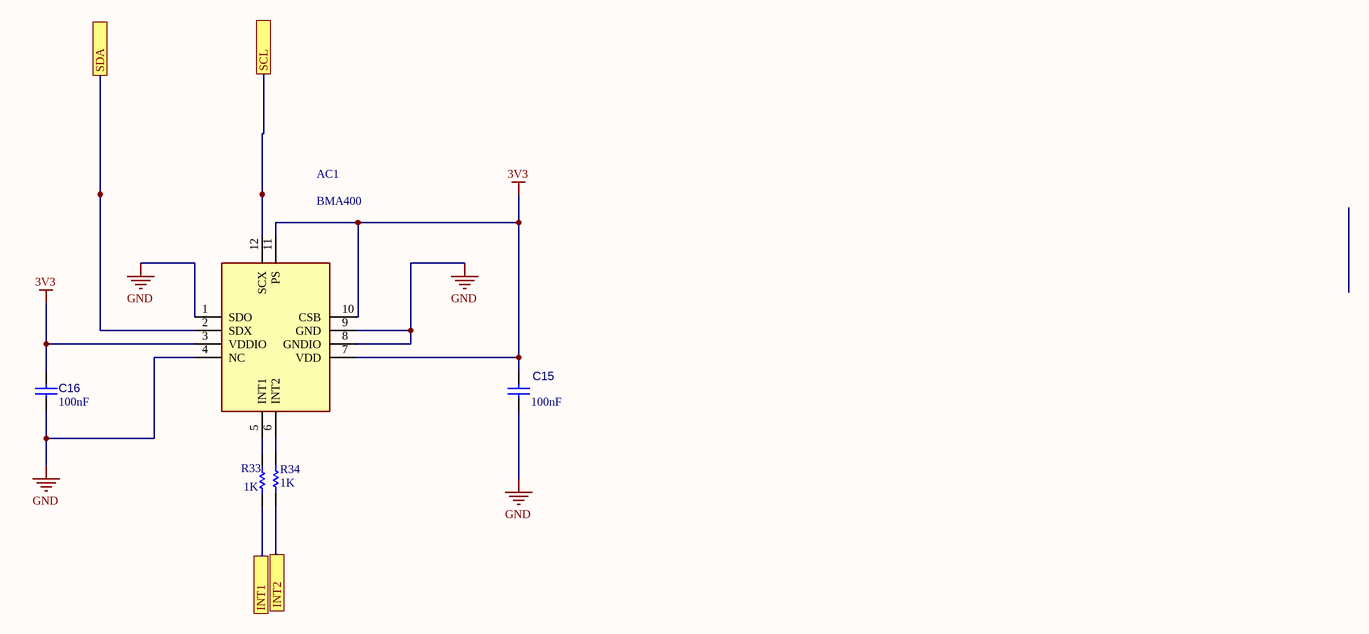
[diagram p5: [7]3-axis-accelerometer.SchDoc]

### Parts
AC1  BMA400  [BMA280]
C15  value 100nF  [CAPC1608X90X40ML10T20]  (hidden comment: Capacitor 100 nF +/-10% 50 V 0603)
C16  value 100nF  [CAPC1608X90X40ML10T20]  (hidden comment: Capacitor 100 nF +/-10% 50 V 0603)
R33  1K  [RES 0603]
R34  1K  [RES 0603]

### Ports
INT1, INT2, SCL, SDA

### Nets
3V3: AC1.3(VDDIO) AC1.7(VDD) AC1.10(CSB) AC1.11(PS) C15.2 C16.2
GND: AC1.1(SDO) AC1.4(NC) AC1.8(GNDIO) AC1.9(GND) C15.1 C16.1
INT1: R33.2 ; port INT1
INT2: R34.2 ; port INT2
SCL: AC1.12(SCX) ; port SCL
SDA: AC1.2(SDX) ; port SDA
NetAC1_5: AC1.5(INT1) R33.1
NetAC1_6: AC1.6(INT2) R34.1

### Library data of the parts
AC1 = BMA280: Accelerometer; Manufacturer_Name: Bosch Sensortec; Datasheet Link: https://ae-bst.resource.bosch.com/media/_tech/media/datasheets/BST-BMA280-DS000.pdf; Height: 1mm; Manufacturer_Part_Number: BMA280; Arrow Part Number: BMA280; Arrow Price/Stock: https://www.arrow.com/en/products/bma280/bosch; Mouser Part Number: 262-BMA280; Mouser Price/Stock: https://www.mouser.co.uk/ProductDetail/Bosch-Sensortec/BMA280?qs=d72FGnIDsgRcX8VH3KFYOw%3D%3D; ComponentLink1Description: docu; ComponentLink1URL: https://www.bosch-sensortec.com/media/boschsensortec/downloads/datasheets/bst-bma280-ds000.pdf
C15 C16 = CMP-001-00017-4: as C2 on sheet [1]MCU; RoHS Compliant: True; Max Operating Temperature: 125°C; Pins: 2; Mounting Technology: SM; Min Operating Temperature: -55°C; Tolerance: 10%; Case/Package: 0603
R33 R34 = RES 3.3M 1% 0.1W [0603]: 1K 1% 0.1W [0603]; Value: 1M; Supplier 1: Digi-Key; Supplier Part Number 1: 541-3.30MHCT-ND; Tolerance: 1%

## Sheet [8]Halleffect.SchDoc
size B
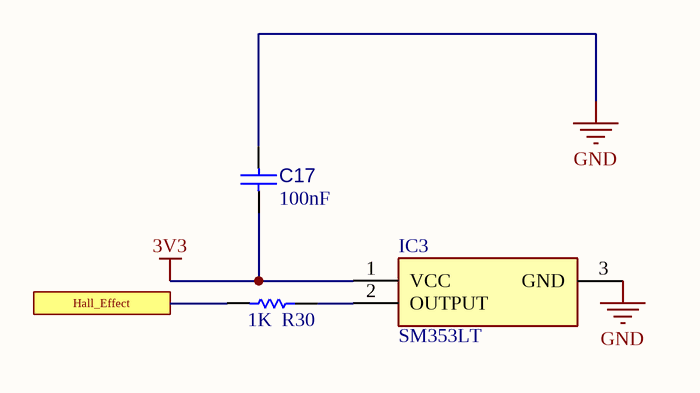
[diagram p6: [8]Halleffect.SchDoc]

### Parts
C17  value 100nF  [CAPC1608X90X40ML10T20]  (hidden comment: Capacitor 100 nF +/-10% 50 V 0603)
IC3  SM353LT  [SOT95P280X145-3N]
R30  1K  [RES 0603]

### Ports
Hall_Effect

### Nets
3V3: C17.1 IC3.1(VCC)
GND: C17.2 IC3.3(GND)
Hall Effect: R30.2 ; port Hall_Effect
NetIC3_2: IC3.2(OUTPUT) R30.1

### Library data of the parts
C17 = CMP-001-00017-4: as C2 on sheet [1]MCU; RoHS Compliant: True; Max Operating Temperature: 125°C; Pins: 2; Mounting Technology: SM; Min Operating Temperature: -55°C; Tolerance: 10%; Case/Package: 0603
IC3 = SM353LT: Integrated Circuit; Manufacturer_Name: Honeywell; Datasheet Link: http://uk.rs-online.com/web/p/products/8252612; Height: 1.45mm; Manufacturer_Part_Number: SM353LT; Arrow Part Number: SM353LT; Arrow Price/Stock: https://www.arrow.com/en/products/sm353lt/honeywell; Mouser Part Number: 785-SM353LT; Mouser Price/Stock: https://www.mouser.co.uk/ProductDetail/Honeywell/SM353LT?qs=sJdZgDoFdSW3aINL1oUyuA%3D%3D; ComponentLink1Description: documentation; ComponentLink1URL: http://www.farnell.com/datasheets/2012450.pdf?_ga=2.245790722.741299232.1603476058-140605836.1598371586&_gac=1.141304070.1603476058.EAIaIQobChMItI734qXL7AIVmRatBh3JPwF_EAAYAiAAEgIk7PD_BwE
R30 = RES 3.3M 1% 0.1W [0603]: 1K 1% 0.1W [0603]; Value: 1M; Supplier 1: Digi-Key; Supplier Part Number 1: 541-3.30MHCT-ND; Tolerance: 1%

## Sheet [9]GPSGNSS.SchDoc
size B
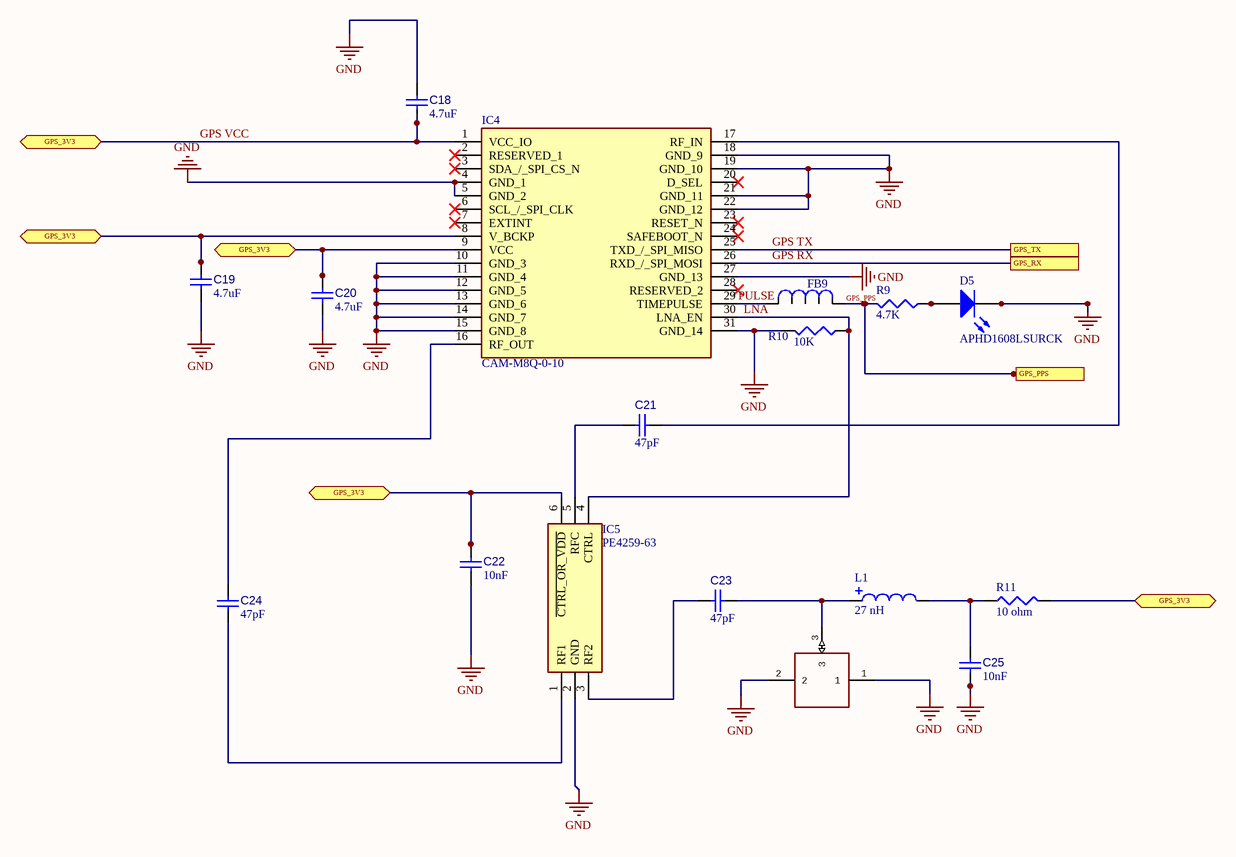
[diagram p7: [9]GPSGNSS.SchDoc]

### Parts
C18  4.7uF  [CAPC1608X90X40ML10T20]
C19  4.7uF  [CAPC1608X90X40ML10T20]
C20  4.7uF  [CAPC1608X90X40ML10T20]
C21  47pF  [CAPC1608X90X40ML10T20]
C22  10nF  [CAPC1608X90X40ML10T20]
C23  47pF  [CAPC1608X90X40ML10T20]
C24  47pF  [CAPC1608X90X40ML10T20]
C25  10nF  [CAPC1608X90X40ML10T20]
CONN2  U.FL-R-SMT-1  [U.FL-R-SMT-1]  (value not drawn)
D5  APHD1608LSURCK  [LED BLUE CLEAR [0603] 2mA]
FB9  BLM18AG102SN1D  [Ferrite Bead]  (value not drawn)
IC4  CAM-M8Q-0-10  [CAM-M8Q]
IC5  PE4259-63  [SOT65P210X110-6N]
L1  27 nH  [INDC1005X55X25ML5T10]
R9  4.7K  [RESC0603]
R10  10K  [RESC0603]
R11  10 ohm  [RESC0603]

### Ports
GPS_3V3 (bidir), GPS_PPS, GPS_RX, GPS_TX

### Nets
GND: C18.1 C19.2 C20.2 C22.1 C25.1 CONN2.1 CONN2.2 D5.1 IC4.4(GND_1) IC4.5(GND_2) IC4.10(GND_3) IC4.11(GND_4) IC4.12(GND_5) IC4.13(GND_6) IC4.14(GND_7) IC4.15(GND_8) IC4.18(GND_9) IC4.19(GND_10) IC4.21(GND_11) IC4.22(GND_12) IC4.27(GND_13) IC4.31(GND_14) IC5.2(GND) R10.2
GPS RX: IC4.26(RXD_/_SPI_MOSI) ; port GPS_RX
GPS TX: IC4.25(TXD_/_SPI_MISO) ; port GPS_TX
GPS VCC: C18.2 C19.1 C20.1 C22.2 IC4.1(VCC_IO) IC4.8(V_BCKP) IC4.9(VCC) IC5.6(~{CTRL_OR_VDD}) R11.2 ; port GPS_3V3
GPS_PPS: FB9.2 R9.2 ; port GPS_PPS
LNA: IC4.30(LNA_EN) IC5.4(CTRL) R10.1
PULSE: FB9.1 IC4.29(TIMEPULSE)
NetC21_1: C21.1 IC5.5(RFC)
NetC21_2: C21.2 IC4.17(RF_IN)
NetC23_1: C23.1 IC5.3(RF2)
NetC23_2: C23.2 CONN2.3 L1.1
NetC24_1: C24.1 IC5.1(RF1)
NetC24_2: C24.2 IC4.16(RF_OUT)
NetC25_2: C25.2 L1.2 R11.1
NetD5_2: D5.2 R9.1

Not connected (* = marked no-connect by the designer): IC4 2(RESERVED_1)* 3(SDA_/_SPI_CS_N)* 6(SCL_/_SPI_CLK)* 7(EXTINT)* 20(D_SEL)* 23(RESET_N)* 24(SAFEBOOT_N)* 28(RESERVED_2)*

### Library data of the parts
C18-C20 = CMP-001-00017-4: as C31 on sheet [5]High_V_Sensor; RoHS Compliant: True; Value: 4.7uF; Max Operating Temperature: 125°C; Pins: 2; Mounting Technology: SM; Min Operating Temperature: -55°C; Tolerance: 10%; Case/Package: 0603
C21 C23 C24 = CMP-001-00017-4: Chip Capacitor, 47pF, +/- 10%, 50 V, 0603 (1608 Metric); Capacitor Type: Ceramic; Voltage Rating: 50V; RoHS Compliant: True; Value: 47pF; Max Operating Temperature: 125°C; Pins: 2; Mounting Technology: SM; Min Operating Temperature: -55°C; Tolerance: 10%; Case/Package: 0603
C22 C25 = CMP-001-00017-4: as C8 on sheet [1]MCU; RoHS Compliant: True; Value: 10nF; Max Operating Temperature: 125°C; Pins: 2; Mounting Technology: SM; Min Operating Temperature: -55°C; Tolerance: 10%; Case/Package: 0603
CONN2 = U.FL-R-SMT-1: GateName_1: G$1; SymbolName_1: U.FL-R-SMT-1; LibraryName: Kris; DeviceSetName: U.FL-R-SMT-1
D5 = LED BLUE CLEAR 1608 SMD: LED RED  [0603] 2mA; Datasheet: http://www.kingbrightusa.com/images/catalog/SPEC/APHD1608LQBC-D.pdf; Supplier 1: Digi-Key; Supplier Part Number 1: 754-2034-1-ND; PN: APHD1608LSURCK
FB9 = Ferrite Bead: Ferrite Bead 1KOhm @100MHz; Datasheet: https://www.murata.com/en-us/products/productdata/8796738650142/ENFA0003.pdf?src-supplier=Digi-Key; Supplier 1: Mouser; Supplier Part Number 1: 81-BLM11A102S; PN: BLM18AG102SN1D
IC4 = CAM-M8Q-0-10: Integrated Circuit; Manufacturer_Name: U-Blox; Datasheet Link: https://www.u-blox.com/sites/default/files/CAM-M8-FW3_DataSheet_%28UBX-15031574%29.pdf; Manufacturer_Part_Number: CAM-M8Q-0-10
IC5 = PE4259-63: Integrated Circuit; Manufacturer_Name: Peregrine Semiconductor; Datasheet Link: https://www.psemi.com/pdf/datasheets/pe4259ds.pdf; Height: 1.1mm; Manufacturer_Part_Number: PE4259-63; ComponentLink1Description: doc; ComponentLink1URL: https://www.psemi.com/pdf/datasheets/pe4259ds.pdf
L1 = CMP-006-00007-2: Chip Inductor, 27 nH, +/- 0.3 nH, 300 mA, -55 to 125 degC, 0402 (1005 Metric), RoHS, Tape and Reel; Manufacturer: Murata; Resistance: 0.15Ohm; Self Resonant Frequency: 6GHz; Tolerance: 5%; Current Rating: 300mA; Inductance: 27nH; Q Factor: 8; Core Material: Air; Shielding: Unshielded; Value: 27 nH; Package Reference: 0402; Case/Package: 0402; Packaging: TapeandReel; Max Operating Temperature: 125°C; RoHS Compliant: True; Package Description: 2-Pin Surface Mount Device, Body 1 x 0.5 mm; Min Operating Temperature: -55°C; Mounting Technology: SM; Pins: 2; Datasheet URL: http://industrial.panasonic.com/cdbs/www-data/pdf/AGA0000/AGA0000C49.pdf; Package Quantity: 10000; Datasheet Version: Sep-10
R9-R11 = RESISTOR

## Sheet [6]Battery Managment.SchDoc
size B
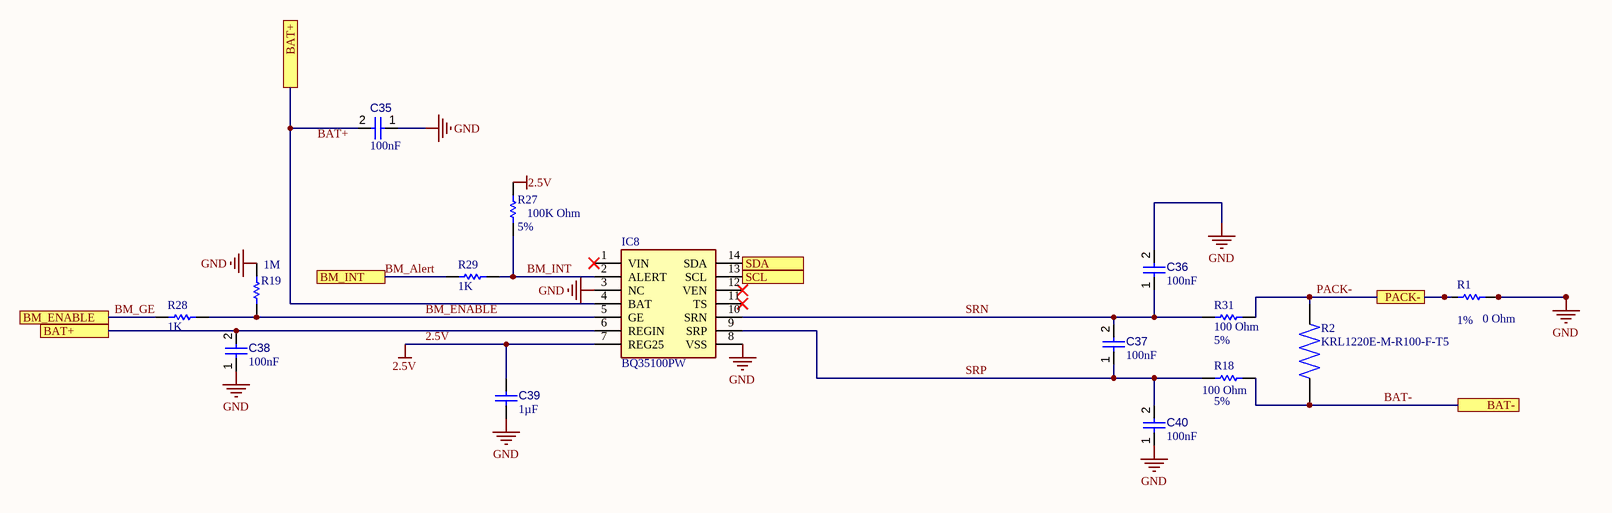
[diagram p8: [6]Battery Managment.SchDoc]

### Parts
(Parts that share a designator on the sheet are numbered #1, #2 ... from top to bottom, then left to right.)
C35  value 100nF  [CAPC1608X90X40ML10T20]  (hidden comment: Capacitor 100 nF +/-10% 50 V 0603)
C36  value 100nF  [CAPC1608X90X40ML10T20]  (hidden comment: Capacitor 100 nF +/-10% 50 V 0603)
C37  value 100nF  [CAPC1608X90X40ML10T20]  (hidden comment: Capacitor 100 nF +/-10% 50 V 0603)
C38  value 100nF  [CAPC1608X90X40ML10T20]  (hidden comment: Capacitor 100 nF +/-10% 50 V 0603)
C39  value 1µF  [CAPC1608X90X40ML10T20]  (hidden comment: Capacitor 1 uF +/- 10% 25 V 0603)
C40  value 100nF  [CAPC1608X90X40ML10T20]  (hidden comment: Capacitor 100 nF +/-10% 50 V 0603)
IC8  BQ35100PW  [SOP65P640X120-14N]
R1#2  value 0 Ohm  Tolerance: 1%  [RESC0603]  (hidden comment: 0)
R2#2  KRL1220E-M-R100-F-T5  [RESC2012X70N]
R18  Tolerance: 5%  [RES 0603]  (hidden comment: 100 Ohm)
R19  1M  [RES 0603]
R27  value 100K Ohm  Tolerance: 5%  [RES 0603]  (hidden comment: RES 100K 5% 0.1W [0603])
R28  1K  [RES 0603]
R29  1K  [RES 0603]
R31  Tolerance: 5%  [RES 0603]  (hidden comment: 100 Ohm)

### Ports
BAT+, BAT-, BM_ENABLE, BM_INT, PACK-, SCL, SDA

### Nets
2.5V: C39.1 IC8.7(REG25) R27.2
GND: C35.1 C36.2 C38.1 C39.2 C40.1 IC8.3(NC) IC8.8(VSS) R1#2.2 R19.2
BAT-: R2#2.1 R18.1 ; port BAT-
BM_Alert: R29.2 ; port BM_INT
BM_ENABLE: IC8.5(GE) R19.1 R28.1
BM_GE: R28.2 ; port BM_ENABLE
BM_INT: IC8.2(ALERT) R27.1 R29.1
PACK-: R1#2.1 R2#2.2 R31.1 ; port PACK-
SCL: IC8.13(SCL) ; port SCL
SDA: IC8.14(SDA) ; port SDA
SRN: C36.1 C37.2 IC8.10(SRN) R31.2
SRP: C37.1 C40.2 IC8.9(SRP) R18.2
VBat In: C35.2 C38.2 IC8.4(BAT) IC8.6(REGIN) ; port BAT+

Not connected (* = marked no-connect by the designer): IC8 1(VIN)* 11(TS)* 12(VEN)*

### Notes on the sheet
- Labels drawn without touching a wire or pin: BAT+

### Library data of the parts
C35-C38 C40 = CMP-001-00017-4: as C2 on sheet [1]MCU; RoHS Compliant: True; Max Operating Temperature: 125°C; Pins: 2; Mounting Technology: SM; Min Operating Temperature: -55°C; Tolerance: 10%; Case/Package: 0603
C39 = CMP-001-00005-4: as C6 on sheet [1]MCU; Min Operating Temperature: -55°C; Tolerance: 10%; Max Operating Temperature: 125°C; Case/Package: 0603; RoHS Compliant: True; Mounting Technology: SM; Pins: 2
IC8 = BQ35100PW: Integrated Circuit; Manufacturer_Name: Texas Instruments; Datasheet Link: http://www.ti.com/lit/gpn/bq35100; Height: 1.2mm; Manufacturer_Part_Number: BQ35100PW; Arrow Part Number: BQ35100PW; Arrow Price/Stock: https://www.arrow.com/en/products/bq35100pw/texas-instruments; Mouser Part Number: 595-BQ35100PW; Mouser Price/Stock: https://www.mouser.co.uk/ProductDetail/Texas-Instruments/BQ35100PW?qs=Jwe3UnxISIaIuldqtot6tg%3D%3D
R1#2 = RES 0 Ohm [0603]: RES 0 Ohm 1% 0.1W [0603]; Supplier 1: Mouser; Supplier Part Number 1: 667-ERJ-3GEY0R00V; Datasheet: http://industrial.panasonic.com/cdbs/www-data/pdf/RDA0000/AOA0000C301.pdf?src-supplier=Farnell
R2#2 = KRL1220E-M-R100-F-T5: 0.1 Ohm current sense resistor; Package: None; Price: None; Value: *; MP: KRL1220E-M-R100-F-T5; Availability: Unavailable
R18 R31 = RES 3.3M 1% 0.1W [0603]: RES 100 Ohm 5% 0.1W [0603]; PN: CRCW06033M30FKEA; Supplier 1: Digi-Key; Supplier Part Number 1: 541-3.30MHCT-ND; Value: 100 Ohm
R19 = RES 3.3M 1% 0.1W [0603]: 1M 1% 0.1W [0603]; Supplier 1: Digi-Key; Supplier Part Number 1: 541-3.30MHCT-ND; Value: 1M; Tolerance: 1%
R27 = RES 1M 1% 0.1W [0603]: PN: CR0603-FX-1004ELF; Supplier 1: Mouser; Supplier Part Number 1: 652-CR0603FX-1004ELF; Datasheet: https://uk.rs-online.com/webdocs/0fcd/0900766b80fcdb72.pdf?src-supplier=RSComponents; Power: 0.1W
R28 R29 = RES 3.3M 1% 0.1W [0603]: 1K 1% 0.1W [0603]; Value: 1M; Supplier 1: Digi-Key; Supplier Part Number 1: 541-3.30MHCT-ND; Tolerance: 1%

## Nets that join several sheets
3V3: [1]MCU (15 pins), [2]Battery (C12.1 IC2.5), [4]Button (BOOT.1 BOOT.2), [5]High_V_Sensor (10 pins), [7]3-axis-accelerometer (6 pins), [8]Halleffect (C17.1 IC3.1)
GND: [1]MCU (29 pins), [2]Battery (8 pins), [3]USB (D2.5 FB4.2 SWD2#2.1), [4]Button (C14.2 R6.1 RESET.1 RESET.2), [7]3-axis-accelerometer (6 pins), [8]Halleffect (C17.2 IC3.3), [9]GPSGNSS (24 pins), [6]Battery Managment (9 pins)
GNDA: [2]Battery (FB11.1), [5]High_V_Sensor (18 pins)
BAT-: [2]Battery (BT1.NEG), [6]Battery Managment (R2#2.1 R18.1)
Boot: [1]MCU (U1.43), [4]Button (BOOT.3 BOOT.4 R6.2)
GPS RX: [1]MCU (FB8.1 SWD2#1.1), [9]GPSGNSS (IC4.26)
GPS TX: [1]MCU (FB7.1 SWD2#1.2), [9]GPSGNSS (IC4.25)
GPS VCC: [2]Battery (C11.1 IC1.5), [9]GPSGNSS (9 pins)
GPS Wakeup: [1]MCU (U1.37), [2]Battery (R32.2)
GPS_PPS: [1]MCU (U1.38), [9]GPSGNSS (FB9.2 R9.2)
Hall Effect: [1]MCU (U1.24), [8]Halleffect (R30.2)
HV Signal: [1]MCU (U1.22), [5]High_V_Sensor (U2.6 U2.7 U3.2 U3.5)
HV Wakeup: [1]MCU (U1.33), [5]High_V_Sensor (FB10.1)
INT1: [1]MCU (U1.39), [7]3-axis-accelerometer (R33.2)
INT2: [1]MCU (U1.40), [7]3-axis-accelerometer (R34.2)
Reset: [1]MCU (U1.34), [4]Button (C14.1 RESET.3 RESET.4)
SCL: [1]MCU (FB6.2 SWD2#1.3), [7]3-axis-accelerometer (AC1.12), [6]Battery Managment (IC8.13)
SDA: [1]MCU (FB5.1 SWD2#1.4), [7]3-axis-accelerometer (AC1.2), [6]Battery Managment (IC8.14)
USB_N: [1]MCU (U1.2), [3]USB (D2.1 D2.2 RN1.3)
USB_P: [1]MCU (U1.1), [3]USB (D2.3 D2.4 RN1.4)
VBat In: [2]Battery (6 pins), [6]Battery Managment (C35.2 C38.2 IC8.4 IC8.6)
VBUS: [1]MCU (U1.20), [3]USB (J1.1 SWD2#2.4)

## Assembly variants
Variant of PCB_High_Voltage_Sensor: not fitted BT1 FB2 FB3 J2 SWD1 SWD2